# EasyEDA Pro project Sprig-C3 V1.0.1.epro, board PCB7
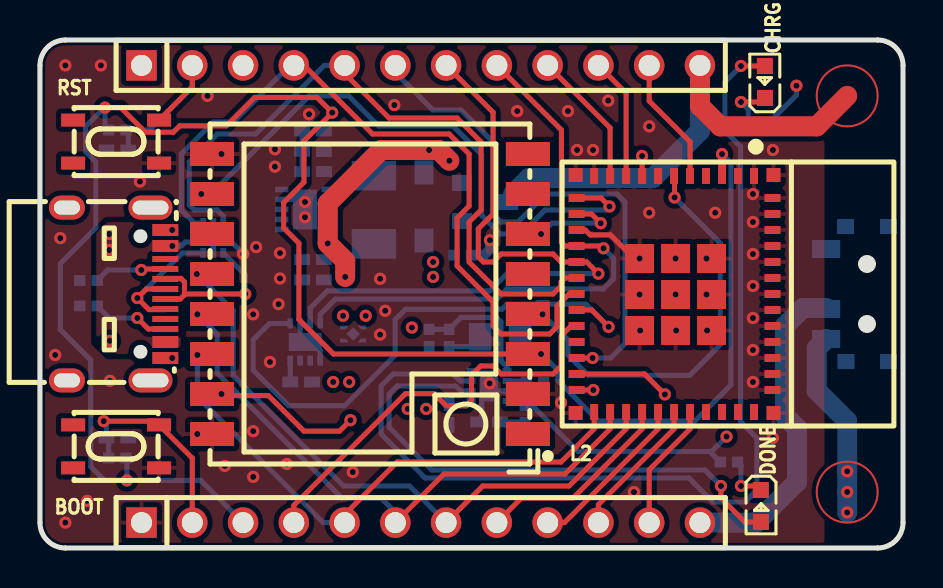
[diagram p10: board, top side]
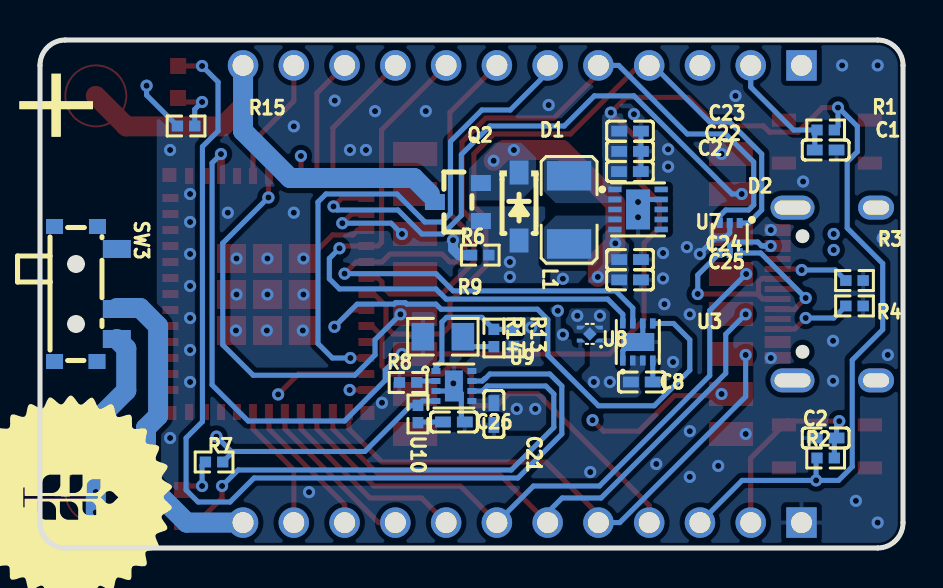
[diagram p11: board, bottom side, seen from below]

Outline 43.18 x 25.4 mm; copper layers: Top Layer, Inner1, Inner2, Bottom Layer. Coordinates in mm from the lower left corner of the outline.
Outline path: 0,24.13 0,1.27 arc(0.37,0.37) 1.27,0 41.91,0 arc(42.81,0.37) 43.18,1.27 43.18,24.13 arc(42.81,25.03) 41.91,25.4 1.27,25.4 arc(0.37,25.03) 0,24.13
Stack: Top Layer 0.035mm Outer layer thickness 1oz / Dielectric1 0.2104mm 7628 RC49% 8.6mil / Inner1 0.0152mm Inner layer thickness / Dielectric2 1.065mm 1.1mm H/HOZ Copper / Inner2 0.0152mm Inner layer thickness / Dielectric3 0.2104mm 7628 RC49% 8.6mil / Bottom Layer 0.035mm Outer layer thickness 1oz

## Design rules (mm)
template: Custom Config
spacing copperThickness1oz (default): track to track 0.102, other pairs 0.152 to 0.3
spacing copperThickness2oz: track to track 0.203, other pairs 0.152 to 0.3
track width copperThickness1oz (default): min 0.127, default 0.254, max 2.54
track width copperThickness2oz: min 0.203, default 0.254, max 2.54
differential pair differentialPair (default): width min 0.127, default 0.254, max 2.54; gap min 0.152, default 0.152
via viaSize (default): diameter min 0.5, default 0.61, max 10; hole min 0.3, default 0.305, max 6.3
net VBAT uses solid
net 3.3V uses solid
net VIN uses solid
net VCC uses solid
net B- uses solid
net $2N1703 uses solid
pour e719 uses solid

## Placement (name value [footprint] x y rotation side)
BOOT  TSA016A2518C  [SW-SMD_4P-L4.2-W3.3-P2.15-LS4.6]  3.81 5.08 0 top
C1  100nF  [C0402]  3.87 19.9 0 bottom
C2  100nF  [C0402]  3.87 5.5 180 bottom
C8  100nF  [C0402]  13.07 8.3 0 bottom
C21  10uF  [C0402]  20.47 6.7 90 bottom
C22  10uF  [C0402]  13.66 19.83 0 bottom
C23  10uF  [C0402]  13.66 20.84 0 bottom
C24  10uF  [C0402]  13.66 14.42 0 bottom
C25  1nF  [C0402]  13.66 13.41 0 bottom
C26  10uF  [C0402]  22.47 6.3 0 bottom
C27  1nF  [C0402]  13.67 18.82 0 bottom
CHRG  NCD0603O3  [LED0603-RD]  36.27 23.3 90 top
D1  B5819W SL  [SOD-123_L2.7-W1.6-LS3.7-RD-1]  19.21 17.08 270 bottom
D2  USBLC6-2P6  [SOT-666-6_L1.6-W1.2-P0.50-LS1.6-BL]  8.67 15.5 0 bottom
DONE  XL-1608UGC-04  [LED0603-RD_GREEN]  36.07 2.1 270 top
H1  HC-PZ254-11.5L-1x12PZ  [HDR-TH_12P-P2.54-V-M]  19.05 24.13 0 top
H2  HC-PZ254-11.5L-1x12PZ  [HDR-TH_12P-P2.54-V-M]  19.05 1.27 0 top
L1  2.2uH  [L1210]  16.71 16.91 90 bottom
L2  Ra-01SC-I  [COMM-SMD_16P-L17.0-W16.0-P2.00-1]  16.51 12.7 180 top
NOREF  -  [Pad_e22619]  40.39 22.61 0 top
NOREF#2  -  [Pad_e22618]  40.39 2.79 0 top
Q2  AO3401A  [SOT-23_L2.9-W1.3-P1.90-LS2.4-BR]  22.27 17.3 180 bottom
R1  10kΩ  [R0402]  3.87 20.9 180 bottom
R2  10kΩ  [R0402]  3.87 4.5 0 bottom
R3  5.1kΩ  [R0402]  2.43 13.37 180 bottom
R4  5.1kΩ  [R0402]  2.43 12.1 0 bottom
R6  10kΩ  [R0402]  21.15 14.64 180 bottom
R7  200Ω  [R0402]  34.47 4.3 0 bottom
R8  2kΩ  [R0402]  24.76 8.28 180 bottom
R9  FNTC0805X104F4250FB  [R0805]  23.02 10.56 180 bottom
R13  100kΩ  [R0402]  19.47 10.5 90 bottom
R14  62kΩ  [R0402]  20.47 10.5 90 bottom
R15  680Ω  [R0402]  35.87 21.1 180 bottom
RST  TSA016A2518C  [SW-SMD_4P-L4.2-W3.3-P2.15-LS4.6]  3.81 20.32 0 top
SW3  MK-12C03-G015  [SW-SMD_MK-12C03-G015]  40.89 12.7 270 bottom
U1  ESP32-C6-MINI-1-N4  [WIFIM-SMD_61P-L16.6-W13.2-P0.80-ESP32-C6-MINI-1-N4]  31.75 12.7 270 top
U3  MAX17048G+T10  [DFN-8_L2.0-W2.0-P0.50-BL-EP]  13.27 10.3 180 bottom
U7  TPS63031DSKR  [SON-10_L2.5-W2.5-P0.50-TL-EP]  13.26 16.93 180 bottom
U8  AP6683  [DFN-4_L1.0-W1.0-P0.65-BL-EP]  15.67 10.7 90 bottom
U9  LGS4056H  [DFN-8_L2.0-W2.0-P0.50-TL-EP1.6]  22.47 8.1 180 bottom
U10  1Ω  [R0402]  24.27 6.7 270 bottom
USB1  U262-161N-4BVC11  [USB-3.1-SMD_U262-161N-4BVC11]  3.81 12.7 270 top

## Footprints (pads in the part's own frame, mm; a bottom-side part is the same pattern mirrored in y, then rotated)
C0402
  rect 0.79x0.54 smd: 1(-0.545,0) 2(0.545,0)
COMM-SMD_16P-L17.0-W16.0-P2.00-1
  rect 2.2x1.2 smd: 1(-7.9,7) 2(-7.9,5) 3(-7.9,3) 4(-7.9,1) 5(-7.9,-1) 6(-7.9,-3) 7(-7.9,-5) 8(-7.9,-7) 9(7.9,-7) 10(7.9,-5) 11(7.9,-3) 12(7.9,-1) 13(7.9,1) 14(7.9,3) 15(7.9,5) 16(7.9,7)
DFN-4_L1.0-W1.0-P0.65-BL-EP
  custom 0.2x0.4 smd: 1(-0.325,-0.475) 2(0.325,-0.474) 3(0.325,0.475) 4(-0.325,0.475)
  rect 0.48x0.48 smd rot 135: 5(0.004,0.001)
DFN-8_L2.0-W2.0-P0.50-BL-EP
  rect 0.28x0.505 smd: 1(-0.75,-0.927) 2(-0.25,-0.927) 3(0.25,-0.927) 4(0.75,-0.927) 5(0.75,0.927) 6(0.25,0.927) 7(-0.25,0.927) 8(-0.75,0.927)
  rect 1.65x0.9 smd: 9(0,0)
DFN-8_L2.0-W2.0-P0.50-TL-EP1.6
  rect 0.45x0.3 smd: 1(-0.9,0.75) 2(-0.9,0.25) 3(-0.9,-0.25) 4(-0.9,-0.75) 5(0.9,-0.75) 6(0.9,-0.25) 7(0.9,0.25) 8(0.9,0.75)
  rect 0.9x1.55 smd: 9(-0.001,0.002)
HDR-TH_12P-P2.54-V-M
  rect 1.524x1.524 hole 1.05: 1(-13.97,0)
  round 1.524 hole 1.05: 2(-11.43,0) 3(-8.89,0) 4(-6.35,0) 5(-3.81,0) 6(-1.27,0) 7(1.27,0) 8(3.81,0) 9(6.35,0) 10(8.89,0) 11(11.43,0) 12(13.97,0)
L1210
  rect 1.474x2.22 smd: 1(-1.703,0) 2(1.703,0)
LED0603-RD
  rect 0.8x0.8 smd: 1(-0.799,-0.004) 2(0.799,0.004)
LED0603-RD_GREEN
  rect 0.8x0.8 smd: 1(-0.799,-0.004) 2(0.799,0.004)
Pad_e22618
  custom 3.048x3.048 smd: 54(0,0)
Pad_e22619
  custom 3.048x3.048 smd: 55(0,0)
R0402
  rect 0.566x0.54 smd: 1(-0.433,0) 2(0.433,0)
R0805
  rect 1.133x1.377 smd: 1(-1,0) 2(1,0)
SOD-123_L2.7-W1.6-LS3.7-RD-1
  rect 1.2x0.95 smd: 1(-1.7,0) 2(1.7,0)
SON-10_L2.5-W2.5-P0.50-TL-EP
  rect 0.665x0.28 smd: 1(-1.157,1) 2(-1.157,0.5) 3(-1.157,0) 4(-1.157,-0.5) 5(-1.157,-1) 6(1.157,-1) 7(1.157,-0.5) 8(1.157,0) 9(1.157,0.5) 10(1.157,1)
  rect 1.2x2 smd: 11(0,0)
SOT-23_L2.9-W1.3-P1.90-LS2.4-BR
  rect 1x0.8 smd: 1(1.15,-0.95) 2(1.15,0.95) 3(-1.15,0)
SOT-666-6_L1.6-W1.2-P0.50-LS1.6-BL
  rect 0.3x0.5 smd: 1(-0.5,-0.75) 2(0,-0.75) 3(0.5,-0.75) 4(0.5,0.75) 5(0,0.75) 6(-0.5,0.75)
SW-SMD_4P-L4.2-W3.3-P2.15-LS4.6
  rect 1.2x0.65 smd: 1(-2.15,1.075) 2(2.15,1.075) 3(-2.15,-1.075) 4(2.15,-1.075)
SW-SMD_MK-12C03-G015
  rect 0.9x1.4 smd: 1(-2.251,1.558) 2(0.75,1.558) 3(2.25,1.558)
  rect 0.75x0.85 smd: 4(-3.375,0.592) 5(-3.375,-1.558) 6(3.375,0.567) 7(3.375,-1.558)
USB-3.1-SMD_U262-161N-4BVC11
  rect 0.6x1.3 smd: A1B12(-3.2,2.462) A4B9(-2.4,2.462) B1A12(3.2,2.462) B4A9(2.4,2.462)
  rect 0.3x1.3 smd: A5(-1.25,2.462) A6(-0.25,2.462) A7(0.25,2.462) A8(1.25,2.462) B5(1.75,2.462) B6(0.75,2.462) B7(-0.75,2.462) B8(-1.75,2.462)
  oval 1.2x2.2 hole 0.7x1.8: SHELL(-4.32,1.719) SHELL(4.32,1.719)
  oval 1.2x1.8 hole 0.7x1.3: SHELL(-4.32,-2.462) SHELL(4.32,-2.462)
WIFIM-SMD_61P-L16.6-W13.2-P0.80-ESP32-C6-MINI-1-N4
  rect 0.8x0.4 smd: 1(-5.9,3.975) 2(-5.9,3.175) 3(-5.9,2.375) 4(-5.9,1.575) 5(-5.9,0.775) 6(-5.9,-0.025) 7(-5.9,-0.825) 8(-5.9,-1.625) 9(-5.9,-2.425) 10(-5.9,-3.225) 11(-5.9,-4.025) 25(5.9,-4.025) 26(5.9,-3.225) 27(5.9,-2.425) 28(5.9,-1.625) 29(5.9,-0.825) 30(5.9,-0.025) 31(5.9,0.775) 32(5.9,1.575) 33(5.9,2.375) 34(5.9,3.175) 35(5.9,3.975)
  rect 0.4x0.8 smd: 12(-4.8,-4.9) 13(-4,-4.9) 14(-3.2,-4.9) 15(-2.4,-4.9) 16(-1.6,-4.9) 17(-0.8,-4.9) 18(0,-4.9) 19(0.8,-4.9) 20(1.6,-4.9) 21(2.4,-4.9) 22(3.2,-4.9) 23(4,-4.9) 24(4.8,-4.9) 36(4.8,4.9) 37(4,4.9) 38(3.2,4.9) 39(2.4,4.9) 40(1.6,4.9) 41(0.8,4.9) 42(0,4.9) 43(-0.8,4.9) 44(-1.6,4.9) 45(-2.4,4.9) 46(-3.2,4.9) 47(-4,4.9) 48(-4.8,4.9)
  rect 1.45x1.45 smd: 49(-1.775,1.85) 49(-1.775,0.05) 49(-1.775,-1.75) 49(0.025,1.85) 49(0.025,0.05) 49(0.025,-1.75) 49(1.825,1.85) 49(1.825,0.05) 49(1.825,-1.75)
  rect 0.7x0.7 smd: 50(5.95,4.95) 51(5.95,-4.95) 52(-5.95,-4.95) 53(-5.95,4.95)

## Nets
As in the schematic, except:
VBAT: C8.2 C21.2 H1.12 NOREF.55 Q2.3 U3.2 U3.3 U8.1 U9.5
B-_C: NOREF#2.54 SW3.3

Pads without a net: BOOT 1 3; H1 3; L2 1 5 7 8 11; RST 1 3; SW3 1 4 5 6 7; U1 4 7 21 32 33 34 35; U7 3 6 7 8 10; USB1 A8 B8 SHELL

## Via types
v1: diameter 0.61, hole 0.305, Top Layer to Bottom Layer, 118 vias

## Routing (per net, layer and track width the routed paths; a pad name or vN(x,y) marks a point on that pad's centre or on a via; arc(x,y) is an arc through that point)
3.3V: length 92.6
  Top Layer w0.254: v1(3.25,22.02) 4.04,22.02 5.08,20.98 5.08,20.95 5.24,20.79 6.68,20.79 6.99,21.11 9.32,21.11 10.74,22.53 13.86,22.53 v1(14.62,21.77) 13.21,20.36 13.21,18.29 12.19,17.27 12.19,16 12.95,15.24 12.95,11.43 14.68,9.7 L2.3
  Top Layer w0.4: v1(34.12,19.7) U1.3
  Bottom Layer w0.254: v1(25.07,9.7) 25.1,9.7 25.91,8.89 25.91,8.38 27.94,6.35 32.77,6.35 34.57,8.15 34.57,19.25 v1(34.12,19.7) ; v1(4.35,3.38) 8.05,3.38 H2.3 ; v1(4.35,3.38) 3.22,3.38 2.54,4.06 2.54,9.4 1.02,10.92 1.02,14.22 2.79,16 2.79,19.3 2.29,19.81 2.29,21.08 3.22,22.02 v1(3.25,22.02) 3.25,21.08 R1.2 ; v1(4.35,3.38) 4.35,4.45 R2.2
GND: length 17.5
  Top Layer w0.254: U1.14 27.28,15.9 27.53,15.66 28.54,15.66 29.72,14.48 v1(30,14.48)
  Bottom Layer w0.254: C8.1 12.52,8.31 U3.4 ; v1(10.17,14.7) 10.17,14.73 9.4,15.49 8.92,15.49 8.67,15.75 D2.2 ; U3.6 13.02,10.55 U3.9 13.52,10.05 13.83,10.05 14.02,9.86 U3.1 ; v1(13.26,17.3) 13.13,17.43 U7.9 ; C26.1 22.1,6.47 22.1,7.73 U9.9 22.72,7.85 U9.3 ; C23.1 C22.1 13.11,18.83 C27.1
  Bottom Layer w0.5: v1(22.51,15.39) 22.51,14.94 22.21,14.64 R6.1
  vias: v1(0.76,9.65) v1(1.02,15.49) v1(1.27,24.13) v1(1.27,1.27) v1(2.36,2.36) v1(3.05,24.13) v1(3.5,10.36) v1(3.5,8.36) v1(5,18.32) v1(6.62,15.9) v1(6.62,9.5) v1(7.87,5.7) v1(8.38,22.61) v1(9.08,19.7) v1(9.25,4.1) v1(10.67,11.68) v1(10.67,5.84) v1(10.67,3.56) v1(10.81,15.05) v1(11.51,9.3) v1(11.75,19.94) v1(11.75,19.07) v1(12.01,14.75) v1(12.01,13.48) v1(11.94,12.19) v1(12.35,4.2) v1(13.26,16.54) v1(13.46,21.69) v1(15.65,3.8) v1(17.02,13.46) v1(17.02,10.67) v1(17.27,11.86) v1(17.73,22.15) v1(22.5,8.23) v1(23.88,21.84) v1(26.07,7.26) v1(26.42,21.84) v1(26.87,19.9) v1(27.67,19.9) v1(28.43,22.37) v1(29.72,2.79) v1(30,12.67) v1(30.03,10.88) v1(30.48,21.08) v1(30.48,16.76) v1(31.8,14.48) v1(31.8,12.67) v1(31.83,10.88) v1(33.35,14.48) v1(33.35,12.67) v1(33.38,10.88) v1(33.78,16.76) v1(35.67,17.7) v1(35.67,16.3) v1(35.67,14.7) v1(35.67,13.1) v1(35.67,11.5) v1(35.67,9.9) v1(35.67,8.3) v1(36.67,19.9) v1(36.67,5.5)
VBAT: length 54
  Top Layer w1: H1.12 33.02,22.1 34.04,21.08 38.86,21.08 NOREF.55
  Inner2 w1: v1(14.67,8.3) v1(15.47,8.3) 16.81,6.95 v1(18.4,6.95) v1(19.33,6.95) 19.33,7.46 26.16,14.3 26.16,16.61 28.1,18.54 30.73,18.54 32.77,20.57 32.77,23.88 H1.12
  Bottom Layer w1: 23.67,17.7 24.47,18.5 30.67,18.5 33.02,20.85 H1.12
VCC: length 106.6
  Inner2 w0.254: v1(18.61,11.02) 18.61,10.77 17.63,9.79 14.87,9.79 13.72,8.64 13.72,7.11 15.24,5.59 26.92,5.59 29.03,7.7 29.03,14.55 29.97,15.49 30.99,15.49 32.36,16.87 ; 32.36,16.87 35.05,19.56 35.05,20.32 v1(37.85,23.11) ; 32.36,16.87 34.35,14.88 v1(34.35,5.57)
  Inner2 w1: H1.1 5.08,23.37 ; 5.08,23.37 5.08,20.31 3.47,18.7 v1(3.47,15.7) v1(3.47,14.9) ; 5.08,23.37 6.86,21.59 11.68,21.59 15.75,17.53 16.76,17.53 19.67,14.62 v1(19.67,14.3) v1(19.67,13.55) 19.67,12.08 v1(18.61,11.02)
  Bottom Layer w0.254: R7.1 33.61,4.73 33.61,4.83 ; R15.1 37.85,22.64 v1(37.85,23.11) ; U9.4 24.05,7.35 U10.1 24.62,7.13 26.92,4.83 33.61,4.83 ; 33.61,4.83 v1(34.35,5.57) ; D2.5 8.67,15.1 8.47,15.3 7.27,15.3 7.08,15.11 6.97,15.11 6.97,15.1 v1(6.62,15.1)
VIN: length 11.5
  Top Layer w1: v1(20.48,19.36) 19.94,19.9 v1(19.47,19.9) 17.07,19.9 14.4,17.23 v1(14.4,15.23) 15.27,14.36 v1(15.27,13.55)
ALRT: length 27.9
  Top Layer w0.254: U1.19 27.61,11.9 v1(28.45,11.06)
  Bottom Layer w0.254: U3.5 11.48,11.23 10.67,10.41 10.67,8.89 12.45,7.11 15.24,7.11 17.77,9.64 17.77,11.42 18.29,11.94 23.11,11.94 23.37,12.19 24.83,12.19 24.9,12.27 25.39,12.27 25.46,12.19 27.31,12.19 v1(28.45,11.06)
B-: length 54.1
  Inner2 w1: v1(16.3,11.61) v1(15.16,11.61) 14.41,11.61 12.7,9.91 12.7,6.6 14.55,4.75 27.61,4.75 29.96,7.1 29.96,7.95 30.91,8.89 32,8.89 33.02,7.87 H2.12
  Bottom Layer w1: 39.34,12 38.17,12 37.27,11.1 37.27,6.61 37.88,6 37.88,3.31 35.84,1.27 H2.12
B-_C: length 9.5
  Bottom Layer w1: v1(40.39,1.78) v1(40.39,2.8) v1(40.39,3.83) 40.39,6.35 38.86,7.87 38.86,9.98 SW3.3
BUSY: length 29.5
  Top Layer w0.254: U1.12 28.07,17.5 v1(28.49,17.08)
  Bottom Layer w0.254: v1(28.49,17.08) 28.32,16.9 25.27,16.9 24.07,15.7 23.03,15.7 22.1,16.63 22.1,19.67 20.67,21.1 16.95,21.1 15.44,22.61 13.46,22.61 8.56,17.7 v1(8.07,17.7)
D02: length 6.4
  Top Layer w0.254: U1.5 32.53,20.31 30.48,22.35 H1.11
D04: length 6.1
  Top Layer w0.254: 29.33,18.6 29.33,22.75 H1.10
D05: length 6.8
  Top Layer w0.254: H1.9 28.53,21.01 U1.10
D08: length 27.6
  Top Layer w0.254: U1.22 v1(27.65,9.5)
  Bottom Layer w0.254: v1(27.65,9.5) 28.55,9.5 29.27,10.22 29.27,17.3 28.87,17.7 25.32,17.7 23.92,16.3 23.07,16.3 22.64,16.73 22.64,20.33 21.07,21.9 19.65,21.9 17.78,23.77 H1.6
D09: length 42
  Top Layer w0.254: v1(3.19,6.34) 5.77,6.34 BOOT.2 7.62,4.5 H2.2 ; U1.23 30.24,8.7 v1(31.26,7.68)
  Inner2 w0.254: H2.2 9.14,2.79 27.18,2.79 31.26,6.88 v1(31.26,7.68)
  Bottom Layer w0.254: v1(3.19,6.34) 3.33,6.21 C2.2 3.44,5.39 R2.1
D15: length 21.2
  Top Layer w0.254: U1.20 26.57,11.1 26.07,10.6 26.07,9.1 25.67,8.7 23.07,8.7 22.67,9.1 22.05,9.1 21.59,8.64 21.59,7.37 21.34,7.11 20.32,7.11 19.71,7.72 18.29,7.72 12.7,2.13 H2.4
D22: length 10.1
  Top Layer w0.254: H2.8 24.09,2.5 26.67,2.5 30.12,5.95 U1.28
D23: length 8.3
  Top Layer w0.254: H2.9 26.24,1.27 30.93,5.95 U1.29
D+: length 37.6
  Top Layer w0.254: H1.4 13.21,24.13 16.64,20.7 20.47,20.7 21.47,19.7 21.47,17.1 20.87,16.5 20.87,14.1 22.67,12.3 22.67,11.1 23.07,10.7 25.5,10.7 25.87,11.07 25.87,12.1 26.47,12.7 U1.18
  Bottom Layer w0.254: D2.1 7.72,16.25 7.07,16.9 7.07,19.7 8.67,21.3 9.67,21.3 12.5,24.13 H1.4
D-: length 35.6
  Top Layer w0.254: H1.5 15.24,23.72 17.46,21.5 20.87,21.5 22.07,20.3 22.07,16.9 21.47,16.3 21.47,14.3 23.07,12.7 25.67,12.7 26.07,13.1 26.07,13.3 26.27,13.5 U1.17
  Bottom Layer w0.254: D2.3 9.17,16.6 8.87,16.9 7.72,16.9 7.47,17.15 7.47,19.3 8.87,20.7 10.79,20.7 14.22,24.13 H1.5
DIO1: length 4.6
  Top Layer w0.254: v1(28.06,16.24) 27.59,16.7 U1.13
  Bottom Layer w0.254: v1(25.07,15.7) 25.61,16.24 v1(28.06,16.24)
DN1: length 8.3
  Top Layer w0.254: 7.23,12.66 7.23,13.3 7.05,13.48 6.3,13.48 USB1.B7 ; 7.23,12.66 7.27,12.7 v1(10.27,12.7) ; 7.23,12.66 7.02,12.45 USB1.A7
  Bottom Layer w0.254: D2.4 10.27,13.65 v1(10.27,12.7)
DP1: length 7.5
  Top Layer w0.254: USB1.A6 5.32,12.95 v1(4.87,12.5) 5.45,11.92 6.24,11.92 USB1.B6
  Bottom Layer w0.254: v1(4.87,12.5) 7.12,14.75 D2.6
EN: length 36.1
  Top Layer w0.254: U1.8 v1(30.12,19.6) ; RST.2 7.62,23.06 H1.2
  Inner2 w0.254: H1.2 7.87,24.13 9.4,22.61 15.29,22.61 16.51,21.39 18.49,21.39 19.71,22.61 27.12,22.61 v1(30.12,19.6)
  Bottom Layer w0.254: C1.2 4.42,20.79 R1.1 5.47,20.9 7.62,23.05 H1.2
RESET: length 20.6
  Top Layer w0.254: 31.73,18.6 31.75,18.58 v1(31.75,17.53)
  Bottom Layer w0.254: v1(31.75,17.53) 34.04,15.24 34.04,10.16 32.51,8.64 27.43,8.64 26.42,9.65 26.42,10.41 v1(25.15,11.68)
RX: length 7.1
  Top Layer w0.254: 31.73,6.8 31.73,5.95 27.94,2.17 H2.10
SCL: length 33.4
  Top Layer w0.254: H1.7 22.67,21.78 22.67,16.7 21.93,15.96 21.93,14.55 22.18,14.3 22.67,14.3 23.07,14.7 25.67,14.7 26.07,14.3 U1.16 27.36,14.3 v1(27.94,13.72)
  Bottom Layer w0.254: v1(27.94,13.72) 23.37,13.72 22.51,12.86 14.38,12.86 13.52,12 U3.7
SDA: length 30
  Top Layer w0.254: v1(28.19,14.99) 28.08,15.1 U1.15 26.27,15.1 26.09,15.28 26.09,20.9 H1.8
  Bottom Layer w0.254: U3.8 14.02,11.68 14.78,12.45 22.86,12.45 23.37,12.95 28.19,12.95 28.7,13.46 28.7,14.48 v1(28.19,14.99)
SPICLK: length 31.3
  Top Layer w0.254: 29.33,6.8 29.33,5.95 26.47,3.1 22.15,3.1 H2.7
  Bottom Layer w0.254: v1(7.85,13.7) 9.67,11.88 9.67,8.62 15.19,3.1 18.49,3.1 H2.7
SPICS2: length 21.3
  Top Layer w0.254: v1(15.53,6.39) 14.99,5.84 13.21,5.84 11.43,7.62 9.16,7.62 v1(9.08,7.7) ; U1.24 v1(27.69,7.9)
  Inner2 w0.254: v1(27.69,7.9) 23.65,7.9 21.84,6.1 15.83,6.1 v1(15.53,6.39)
SPID: length 29.2
  Top Layer w0.254: H2.6 20.21,3.7 26.27,3.7 28.53,5.95 U1.26
  Bottom Layer w0.254: v1(7.87,11.68) 8.87,10.69 8.87,8.74 15.11,2.5 17.06,2.5 17.78,1.78 H2.6
SPIQ: length 27.6
  Top Layer w0.254: H2.5 15.24,1.67 17.87,4.3 26.07,4.3 27.73,5.95 27.73,6.8
  Bottom Layer w0.254: v1(7.87,9.65) 7.87,7.57 14.17,1.27 H2.5
TX: length 6.4
  Top Layer w0.254: U1.31 32.53,5.95 30.48,3.91 H2.11
$2N1502: length 3.6
  Top Layer w0.254: v1(5.07,13.9) 5.12,13.95 USB1.A5
  Bottom Layer w0.254: 2.86,13.37 3.39,13.9 v1(5.07,13.9)
$2N1504: length 3.9
  Top Layer w0.254: v1(4.87,11.5) 5.42,10.95 USB1.B5
  Bottom Layer w0.254: 2.86,12.1 3.46,11.5 v1(4.87,11.5)
$2N3354: length 1.3
  Bottom Layer w0.254: C26.2 24.24,6.3 U10.2
$2N3355: length 1
  Bottom Layer w0.254: U9.2 24.26,8.35 R8.2
$2N3357: length 6.5
  Bottom Layer w0.254: U9.1 23.37,9.05 23.07,9.35 23.07,11.3 22.84,11.53 21.07,11.53 R14.2 R13.2
$2N3358: length 1.8
  Bottom Layer w0.254: 20.47,10.07 21.53,10.07 R9.2
$2N3361: length 51.1
  Top Layer w0.254: v1(35.07,24.1) CHRG.2
  Bottom Layer w0.254: v1(35.07,24.1) 34.27,23.3 34.27,20.85 35.05,20.07 35.05,6.32 35.87,5.5 35.87,2.9 35.27,2.3 33.67,2.3 32.47,3.5 19.27,3.5 17.07,5.7 17.07,8.1 17.67,8.7 20.67,8.7 20.91,8.46 20.94,8.46 21.05,8.35 U9.7
$2N3363: length 2.3
  Top Layer w0.254: DONE.1 35.87,3.1 v1(35.07,3.1)
  Bottom Layer w0.254: R7.2 35.07,4.13 v1(35.07,3.1)
$2N3364: length 27
  Top Layer w0.254: v1(34.07,3.1) 34.07,2.5 35.27,1.3 DONE.2
  Bottom Layer w0.254: U9.6 21.04,7.85 20.79,8.1 17.87,8.1 17.47,7.7 17.47,6.03 19.6,3.9 33.27,3.9 v1(34.07,3.1)
$2N3366: length 2.6
  Top Layer w0.254: CHRG.1 36.07,22.3 v1(35.07,22.3)
  Bottom Layer w0.254: R15.2 35.44,21.93 v1(35.07,22.3)

## Copper pours and planes (outline as drawn; the poured copper is in the pictures)
3.3V on Bottom Layer: 14.76,17.8 15.06,18.09 15.06,21.61 14.93,21.73 13.79,21.73 13.79,18.43 14.04,18.18 14.04,17.8
GND on Top Layer: -4.95,31.72 37.85,31.72 39.25,30.32 39.25,-2.48 2.05,-2.48 -4.95,4.52
GND on Bottom Layer: -14.73,38.35 40.64,38.35 49.78,29.21 39.12,29.21 37.34,27.43 37.34,-2.79 33.53,-6.6 -11.68,-6.6 -11.68,35.31
GND on Inner1: 37.44,32 37.44,-5.84 4.06,-5.84 -11.68,9.91 -11.68,22.61 -2.29,32
GND on Inner2: -2.03,27.69 37.44,27.69 37.44,-7.87 0.25,-7.87 -6.35,-1.27 -6.35,23.37
VBAT on Bottom Layer: 12.67,9.9 12.67,9.17 13.07,8.77 13.07,7.75 13.3,7.52 15.49,7.52 16.07,8.1 16.07,8.7 15.67,9.1 15.67,10.1 15.27,10.5 14.67,10.5 14.07,9.9
VBAT on Bottom Layer: 17.47,8.29 21.13,8.29 21.72,7.7 22.07,7.7 22.07,7.4 22.47,7 21.66,7 21.3,6.65 20.54,6.65 19.76,5.87 18.09,5.87 17.47,6.49
VCC on Top Layer: 7.05,15.19 7.05,9.7 3.42,9.7 2.81,10.31 2.81,15.74 3.38,16.3 7.07,16.3 7.07,15.21
VCC on Bottom Layer: 22.07,8.65 22.07,9.1 21.52,9.65 20.24,9.65 19.97,9.92 19.97,10.76 21.06,11.84 22.01,11.84 22.27,12.1 22.27,13.9 22.07,14.1 21.45,14.1 21.15,14.39 21.15,15.22 21.27,15.34 21.55,15.34 21.87,15.65 21.87,16.77 21.56,17.08 17.9,17.08 17.9,9.27 18.87,8.3 21.72,8.3
VIN on Bottom Layer: 14.75,16.07 14.09,16.07 14.09,15.79 14.09,15.79 14.09,15.55 13.71,15.17 13.71,12.73 16.01,12.73 16.01,13.13 15.08,14.15 15.08,15.74
VIN on Bottom Layer: 21.85,17.38 21.85,18.83 20.42,20.27 19.11,20.27 18.36,19.52 18.36,18.14 19.12,17.38
B- on Bottom Layer: 15.67,10.37 15.33,10.7 14.87,10.7 14.67,10.9 14.67,11.8 14.86,11.99 16.58,11.99 16.87,11.7 16.87,10.9 16.67,10.7 16.01,10.7
$2N1699 on Bottom Layer: 14.17,19.63 17.98,19.63 17.98,17.25 14.17,17.25
$2N1703 on Bottom Layer: 14.17,16.62 17.98,16.62 17.98,14.11 14.17,14.11

## Text on the board
Bottom Silkscreen Layer: - | +
